# EAGLE design untitled (EAGLE 7.6.0)
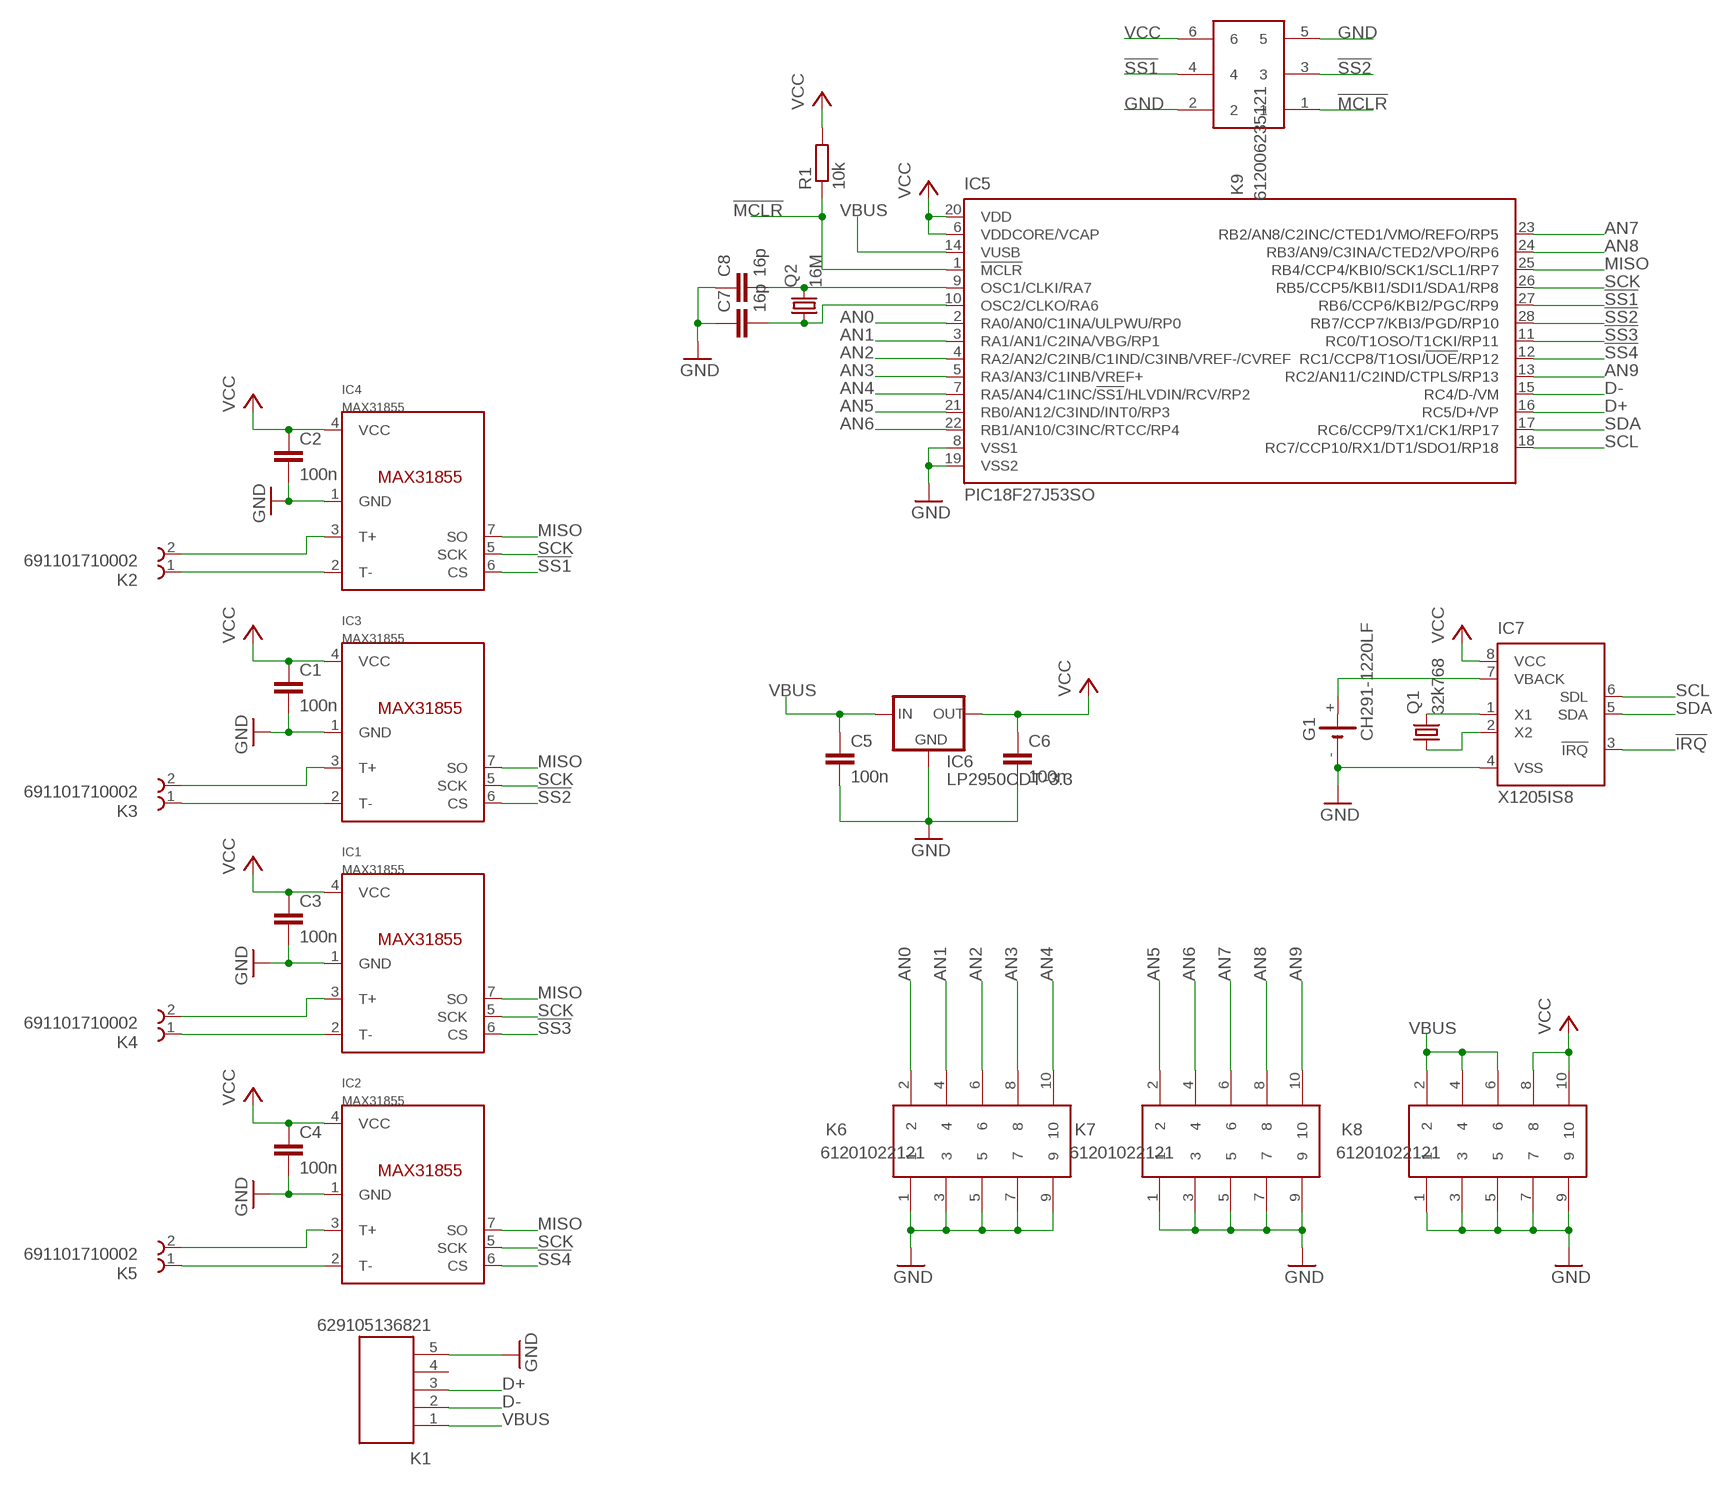
[diagram p0: schematic, sheet 1]

## Parts
C1  100n  C-EUC1206  [C1206]
C2  100n  C-EUC1206  [C1206]
C3  100n  C-EUC1206  [C1206]
C4  100n  C-EUC1206  [C1206]
C5  100n  C-EUC1206  [C1206]
C6  100n  C-EUC1206  [C1206]
C7  16p  C-EUC0805  [C0805]
C8  16p  C-EUC0805  [C0805]
G1  CH291-1220LF  [CH291-1220LF]
IC1  MAX31855  [SOIC8]
IC2  MAX31855  [SOIC8]
IC3  MAX31855  [SOIC8]
IC4  MAX31855  [SOIC8]
IC5  PIC18F27J53SO  [SO28W]
IC6  LP2950CDT-3.3  [DPACK]
IC7  X1205IS8  [SO-08]
K1  629105136821  [629105136821]
K2  691101710002  [691101710002]
K3  691101710002  [691101710002]
K4  691101710002  [691101710002]
K5  691101710002  [691101710002]
K6  61201022121  [61201022121]
K7  61201022121  [61201022121]
K8  61201022121  [61201022121]
K9  612006235121  [612006235121]
Q1  32k768  CRYSTALTC26H  [TC26H]
Q2  16M  CRYSTALCTS406  [CTS406]
R1  10k  R-EU_M1206  [M1206]

## Nets
!IRQ: IC7.3(!IRQ)
!MCLR: IC5.1(!MCLR) K9.1 R1.1
!SS1: IC4.6(CS) IC5.27(RB6/CCP6/KBI2/PGC/RP9) K9.4
!SS2: IC3.6(CS) IC5.28(RB7/CCP7/KBI3/PGD/RP10) K9.3
!SS3: IC1.6(CS) IC5.11(RC0/T1OSO/T1CKI/RP11)
!SS4: IC2.6(CS) IC5.12(RC1/CCP8/T1OSI/!UOE!/RP12)
AN0: IC5.2(RA0/AN0/C1INA/ULPWU/RP0) K6.2
AN1: IC5.3(RA1/AN1/C2INA/VBG/RP1) K6.4
AN2: IC5.4(RA2/AN2/C2INB/C1IND/C3INB/VREF-/CVREF) K6.6
AN3: IC5.5(RA3/AN3/C1INB/VREF+) K6.8
AN4: IC5.7(RA5/AN4/C1INC/!SS1!/HLVDIN/RCV/RP2) K6.10
AN5: IC5.21(RB0/AN12/C3IND/INT0/RP3) K7.2
AN6: IC5.22(RB1/AN10/C3INC/RTCC/RP4) K7.4
AN7: IC5.23(RB2/AN8/C2INC/CTED1/VMO/REFO/RP5) K7.6
AN8: IC5.24(RB3/AN9/C3INA/CTED2/VPO/RP6) K7.8
AN9: IC5.13(RC2/AN11/C2IND/CTPLS/RP13) K7.10
D+: IC5.16(RC5/D+/VP) K1.3
D-: IC5.15(RC4/D-/VM) K1.2
GND: C1.2 C2.2 C3.2 C4.2 C5.2 C6.2 C7.1 C8.1 G1.- IC1.1(GND) IC2.1(GND) IC3.1(GND) IC4.1(GND) IC5.8(VSS1) IC5.19(VSS2) IC6.4(GND) IC7.4(VSS) K1.5 K6.1 K6.3 K6.5 K6.7 K6.9 K7.1 K7.3 K7.5 K7.7 K7.9 K8.1 K8.3 K8.5 K8.7 K8.9 K9.2 K9.5
MISO: IC1.7(SO) IC2.7(SO) IC3.7(SO) IC4.7(SO) IC5.25(RB4/CCP4/KBI0/SCK1/SCL1/RP7)
N$1: IC4.2(T-) K2.1
N$2: IC4.3(T+) K2.2
N$3: IC3.3(T+) K3.2
N$4: IC3.2(T-) K3.1
N$5: IC1.3(T+) K4.2
N$6: IC1.2(T-) K4.1
N$7: IC2.3(T+) K5.2
N$8: IC2.2(T-) K5.1
N$9: IC7.1(X1) Q1.2
N$10: IC7.2(X2) Q1.1
N$11: C8.2 IC5.9(OSC1/CLKI/RA7) Q2.3
N$12: G1.+ IC7.7(VBACK)
N$13: C7.2 IC5.10(OSC2/CLKO/RA6) Q2.1
SCK: IC1.5(SCK) IC2.5(SCK) IC3.5(SCK) IC4.5(SCK) IC5.26(RB5/CCP5/KBI1/SDI1/SDA1/RP8)
SCL: IC5.18(RC7/CCP10/RX1/DT1/SDO1/RP18) IC7.6(SDL)
SDA: IC5.17(RC6/CCP9/TX1/CK1/RP17) IC7.5(SDA)
VBUS: C5.1 IC5.14(VUSB) IC6.1(IN) K1.1 K8.2 K8.4 K8.6
VCC: C1.1 C2.1 C3.1 C4.1 C6.1 IC1.4(VCC) IC2.4(VCC) IC3.4(VCC) IC4.4(VCC) IC5.6(VDDCORE/VCAP) IC5.20(VDD) IC6.3(OUT) IC7.8(VCC) K8.8 K8.10 K9.6 R1.2
Unconnected: K1.4

## Library data of the parts
C1-C8 = rcl:C-EU: CAPACITOR, European symbol
G1 = battery:CH291-1220LF: Battery Holder, SMT, 12mm multicomp PART NO. CH291-1220LF Source: Data sheet <http://www.farnell.com/datasheets/1505860.pdf>
IC1-IC4 = AlexW-Eagle-Libraries:MAX31855
IC5 = microchip:PIC18F2*J53: PIC18F47J53 Family High-Performance USB Microcontrollers with nanoWatt XLP Technology Source: Data sheet <http://ww1.microchip.com/downloads/en/DeviceDoc/39964B.pdf>; MPN: PIC18F27J53-I/SO; OC_FARNELL: unknown; OC_NEWARK: 63R7838
IC6 = v-reg:LP2950?*: Source: http://cache.national.com/ds/LP/LP2950.pdf
IC7 = xicor:X1205*: 2-Wire RTC Real Time Clock/Calendar; OC_FARNELL: unknown; OC_NEWARK: unknown
K1 = Input-Output_Connectors_rev15d:629105136821: WR-COM SMT Horizontal 5 Contacts Micro USB Type B,5 pins=>Code : Con_I-O_COM_MicroUSB_629105136821 <http://katalog.we-online.de/media/images/eican/Con_I-O_COM_MicroUSB_629105136821_pf2.jpg> Details see: http://katalog.we-online.de/en/em/629_105_136_821 Created 2014-07-09, Karrer Zheng 2014 (C) Würth Elektronik
K2-K5 = Terminal_Blocks_Connectors_rev15e:691101710002: WR-TBL Serie 101 - 5.0mm HOrizontal Entry Modular with Pressure Clamp - 2.5mm2 Wires , 2 pins=>Code : Con-TBL_Screw_PressureClamp_691101710002 <http://katalog.we-online.de/media/images/eican/Con-TBL_Screw_PressureClamp_6911017100xx_pf2.jpg> Details see: http://katalog.we-online.de/en/em/691_101_710_0xx Created 2014-06-16, Karrer Zheng 2014 (C) Würth Elektronik
K6-K8 = Wire_to_Board_Connectors_rev15d:61201022121: WR-BHD 2.54mm Male Angled Box Header With Lever, 10 Pins=>Code : Con_WTB_BHD_2.54_Male_THT_WS_61201022121 <http://katalog.we-online.de/media/thumbs2/eican/thb_Con_WTB_BHD_2.54_Male_THT_WS_6120xx22121_pf2.jpg> Details see: http://katalog.we-online.de/en/em/612_0xx_221_21 Created 2014-06-05, Karrer Zheng 2014 (C) Würth Elektronik
K9 = Wire_to_Board_Connectors_rev15d:612006235121: WR-BHD 2.54mm Male Box Header High Temperature, 6 Pins=>Code : Con_WTB_BHD_2.54_Male_THT_RS_612006235121 <http://katalog.we-online.de/media/thumbs2/eican/thb_Con_WTB_BHD_2.54_Male_THT_RS_6120xx235121_pf2.jpg> Details see: http://katalog.we-online.de/en/em/612_0xx_235_121 Created 2014-06-05, Karrer Zheng 2014 (C) Würth Elektronik
Q1 Q2 = crystal:CRYSTAL: CRYSTAL; OC_FARNELL: unknown; OC_NEWARK: unknown
R1 = rcl:R-EU_: RESISTOR, European symbol

## Board
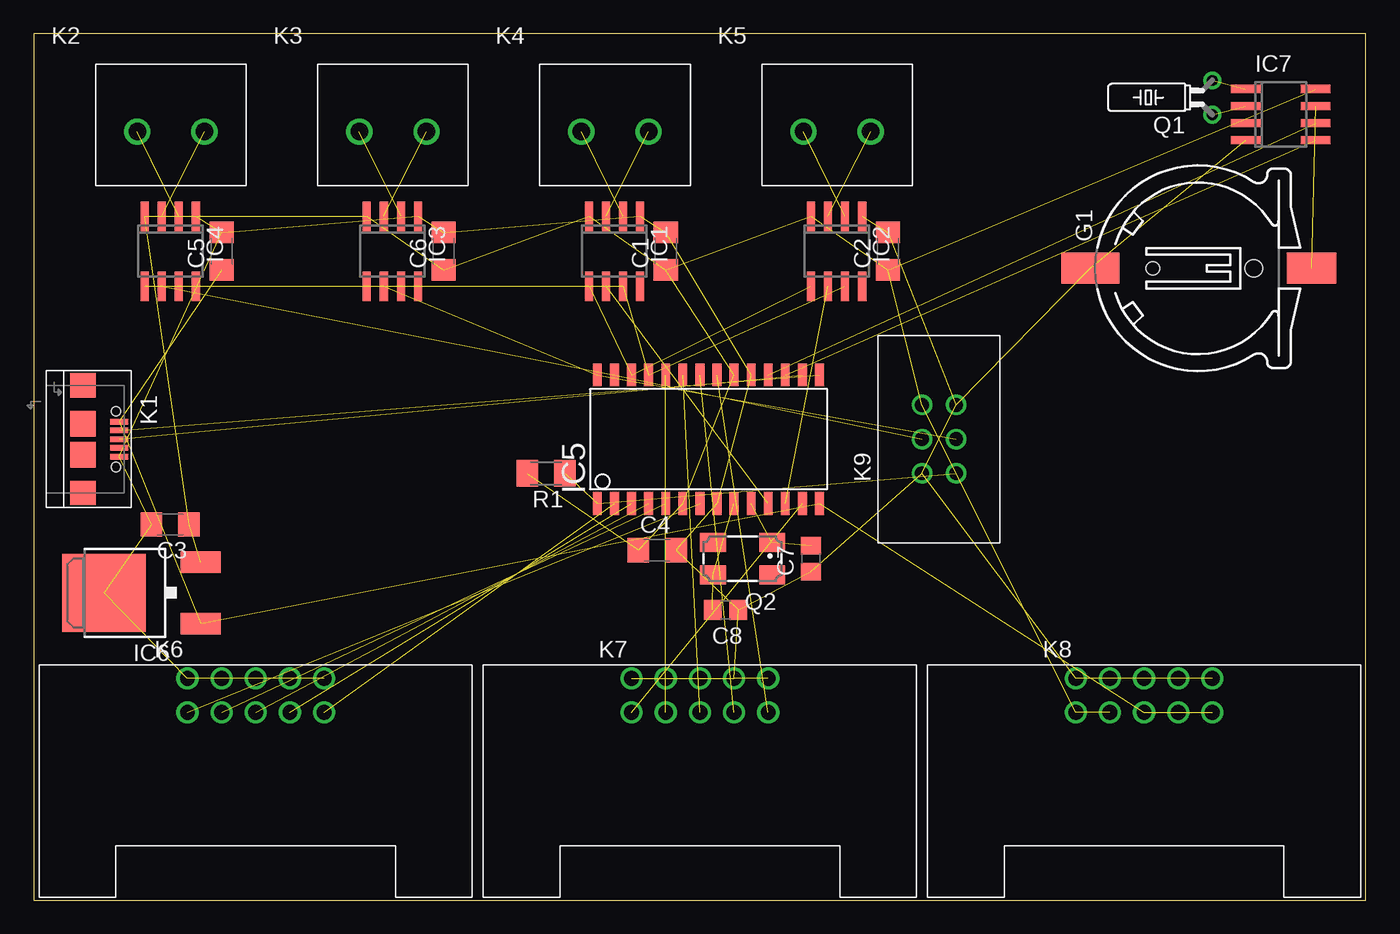
[diagram p1: board, top side]
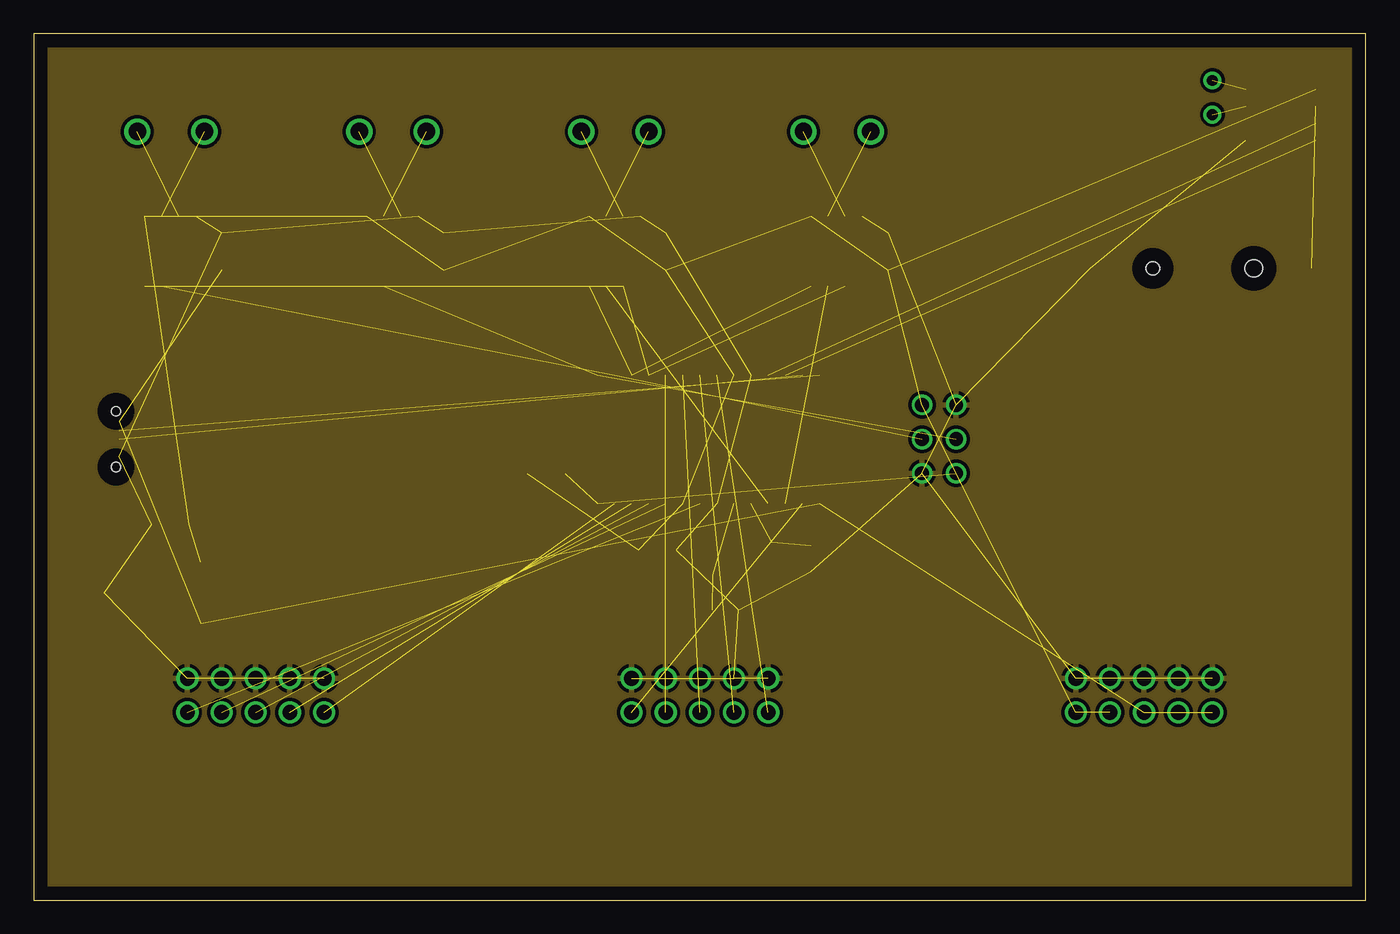
[diagram p2: board, inner layer Route2]
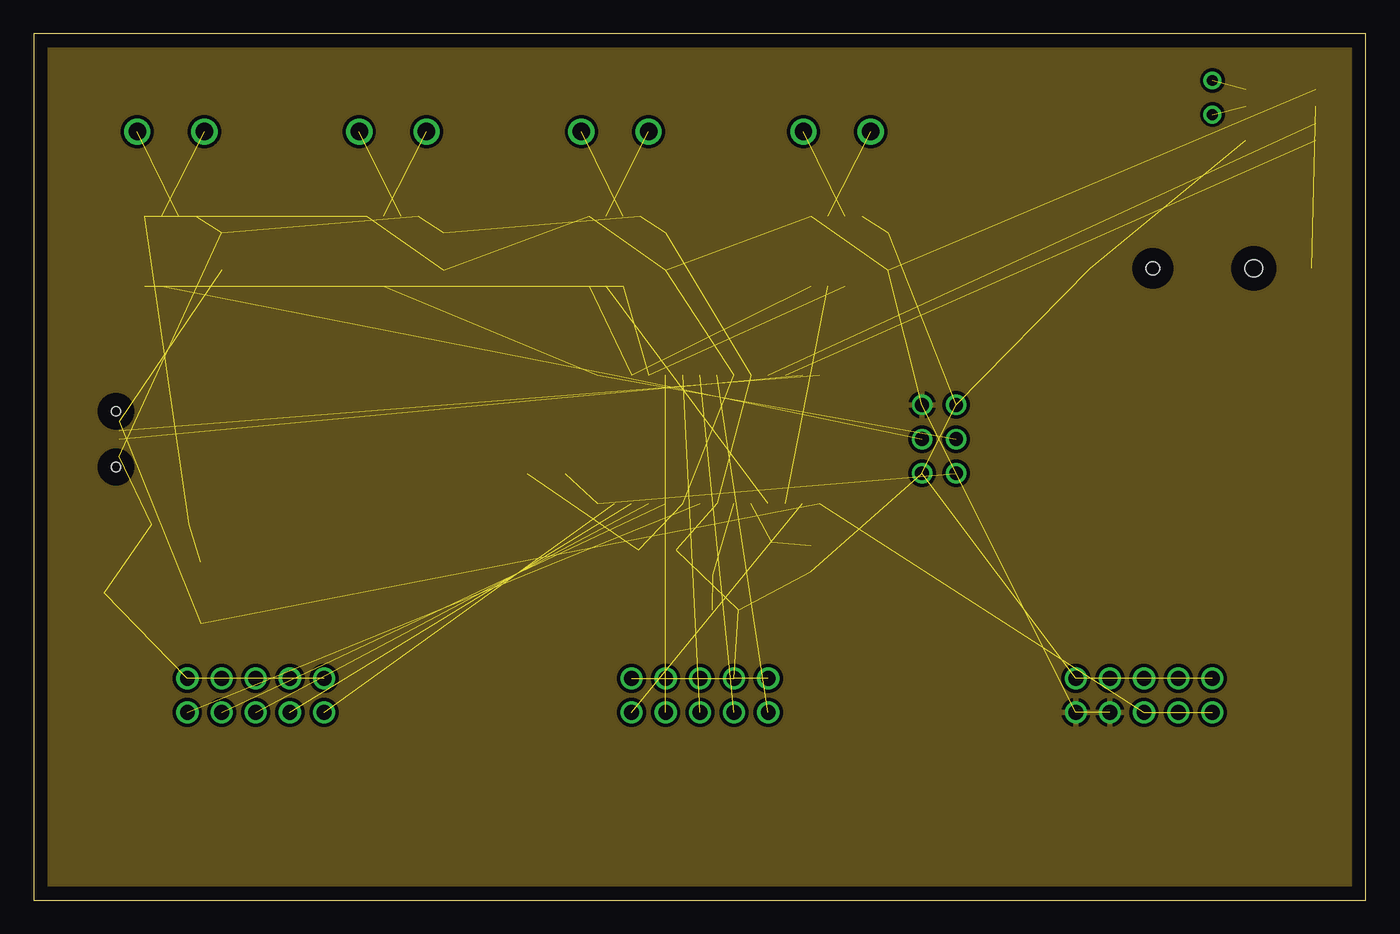
[diagram p3: board, inner layer Route15]

Size 99.04 x 64.44 mm. Coordinates in mm from the lower left corner, seen from the top.
Outline: 0,0 99.04,0 99.04,64.44 0,64.44 0,0
Copper layers (1*2*15*16): Top 0.035mm / dielectric 1.5mm / Route2 0.035mm / dielectric 0.15mm / Route15 0.035mm / dielectric 0.2mm / Bottom 0.035mm
Design rules "default *": minimum track width 10mil, minimum drill 24mil, track to track 8mil, track to pad 8mil, pad to pad 8mil, via to via 8mil, smd to smd 8mil, copper to edge 40mil, drill to drill 8mil, minimum pad ring 10mil, minimum via ring 8mil, stop-mask expansion 4mil, vias tented up to drill 0mil, thermal gap 10mil

### Footprints (pad centres in the part's own frame; a part is rotated, then mirrored left to right if it is on the bottom)
C1206 = smd 1.6 x 1.8: 1 -1.4,0; 2 1.4,0
C0805 = smd 1.3 x 1.5: 1 -0.95,0; 2 0.95,0
CH291-1220LF = smd 2.3 x 3.66: + 0,-2.296 | smd 2.3 x 4.3: - 0,14.146 | hole 1.3: 0,2 | hole 1: 0,9.5
SOIC8 = smd 0.6 x 2.2: 1 -1.905,-2.6; 2 -0.635,-2.6; 3 0.635,-2.6; 4 1.905,-2.6; 5 1.905,2.6; 6 0.635,2.6; 7 -0.635,2.6; 8 -1.905,2.6
SO28W = smd 0.65 x 1.7: 1 -7.62,-4.78; 2 -6.35,-4.78; 3 -5.08,-4.78; 4 -3.81,-4.78; 5 -2.54,-4.78; 6 -1.27,-4.78; 7 0,-4.78; 8 1.27,-4.78; 9 2.54,-4.78; 10 3.81,-4.78; 11 5.08,-4.78; 12 6.35,-4.78; 13 7.62,-4.78; 14 8.89,-4.78; 15 8.89,4.78; 16 7.62,4.78; 17 6.35,4.78; 18 5.08,4.78; 19 3.81,4.78; 20 2.54,4.78; 21 1.27,4.78; 22 0,4.78; 23 -1.27,4.78; 24 -2.54,4.78; 25 -3.81,4.78; 26 -5.08,4.78; 27 -6.35,4.78; 28 -7.62,4.78
DPACK = smd 1.6 x 3: 1 -2.28,-4.8; 3 2.28,-4.8 | smd 5.8 x 6.2: 4 0,2.38
SO-08 = smd 0.6 x 2.2: 1 -1.905,-2.6; 2 -0.635,-2.6; 3 0.635,-2.6; 4 1.905,-2.6; 5 1.905,2.6; 6 0.635,2.6; 7 -0.635,2.6; 8 -1.905,2.6
629105136821 = smd 0.4 x 1.35: 1 -1.3,0; 2 -0.65,0; 3 0,0; 4 0.65,0; 5 1.3,0 | smd 1.8 x 1.9: Z1 -4,-2.675; Z4 4,-2.675 | smd 1.9 x 1.9: Z2 -1.15,-2.675; Z3 1.15,-2.675 | hole 0.7: -2.075,-0.225; 2.075,-0.225
691101710002 = drill 1.3: 1 -5,0; 2 0,0
61201022121 = drill 1.1: 1 5.08,1.27; 2 5.08,-1.27; 3 2.54,1.27; 4 2.54,-1.27; 5 0,1.27; 6 0,-1.27; 7 -2.54,1.27; 8 -2.54,-1.27; 9 -5.08,1.27; 10 -5.08,-1.27
612006235121 = drill 1.02: 1 -2.54,-1.27; 2 -2.54,1.27; 3 0,-1.27; 4 0,1.27; 5 2.54,-1.27; 6 2.54,1.27
TC26H = drill 0.813: 1 -1.27,0; 2 1.27,0
CTS406 = smd 1.9 x 1.4: 1 -2.2,-1.2; 2 2.2,-1.2; 3 2.2,1.2; 4 -2.2,1.2
M1206 = smd 1.6 x 2: 1 -1.4,0; 2 1.4,0

### Placement (x,y rotation side)
C1  46.99,48.26 90 top
C2  63.5,48.26 90 top
C3  10.16,27.94 180 top
C4  46.35,26.04 0 top
C5  13.97,48.26 90 top
C6  30.48,48.26 90 top
C7  57.78,25.4 90 top
C8  51.44,21.59 180 top
G1  92.71,46.99 90 top
IC1  43.18,48.26 180 top
IC2  59.69,48.26 180 top
IC3  26.67,48.26 180 top
IC4  10.16,48.26 180 top
IC5  49.53,34.29 0 top
IC6  7.62,22.86 90 top
IC7  92.71,58.42 270 top
K1  6.35,34.29 270 top
K2  12.7,57.15 0 top
K3  29.21,57.15 0 top
K4  45.72,57.15 0 top
K5  62.23,57.15 0 top
K6  16.51,15.24 0 top
K7  49.53,15.24 0 top
K8  82.55,15.24 0 top
K9  67.31,34.29 90 top
Q1  87.63,59.69 90 top
Q2  52.7,25.4 180 top
R1  38.1,31.75 180 top

### Tracks (layer width: path | path; a pad name or v marks a point on that pad's centre or on a via)
!MCLR  (2 unrouted)
!SS1  (2 unrouted)
!SS2  (2 unrouted)
!SS3  (1 unrouted)
!SS4  (1 unrouted)
AN0  (1 unrouted)
AN1  (1 unrouted)
AN2  (1 unrouted)
AN3  (1 unrouted)
AN4  (1 unrouted)
AN5  (1 unrouted)
AN6  (1 unrouted)
AN7  (1 unrouted)
AN8  (1 unrouted)
AN9  (1 unrouted)
D+  (1 unrouted)
D-  (1 unrouted)
GND  (34 unrouted)
  pour Route2 (isolate 0.254): 0,64.77 99.06,64.77 99.06,0 0,0
MISO  (4 unrouted)
N$1  (1 unrouted)
N$2  (1 unrouted)
N$3  (1 unrouted)
N$4  (1 unrouted)
N$5  (1 unrouted)
N$6  (1 unrouted)
N$7  (1 unrouted)
N$8  (1 unrouted)
N$9  (1 unrouted)
N$10  (1 unrouted)
N$11  (2 unrouted)
N$12  (1 unrouted)
N$13  (2 unrouted)
SCK  (4 unrouted)
SCL  (1 unrouted)
SDA  (1 unrouted)
VBUS  (6 unrouted)
VCC  (16 unrouted)
  pour Route15 (isolate 0.254): 0,64.77 99.06,64.77 99.06,0 0,0